# EAGLE design LDR (EAGLE 9.6.2)
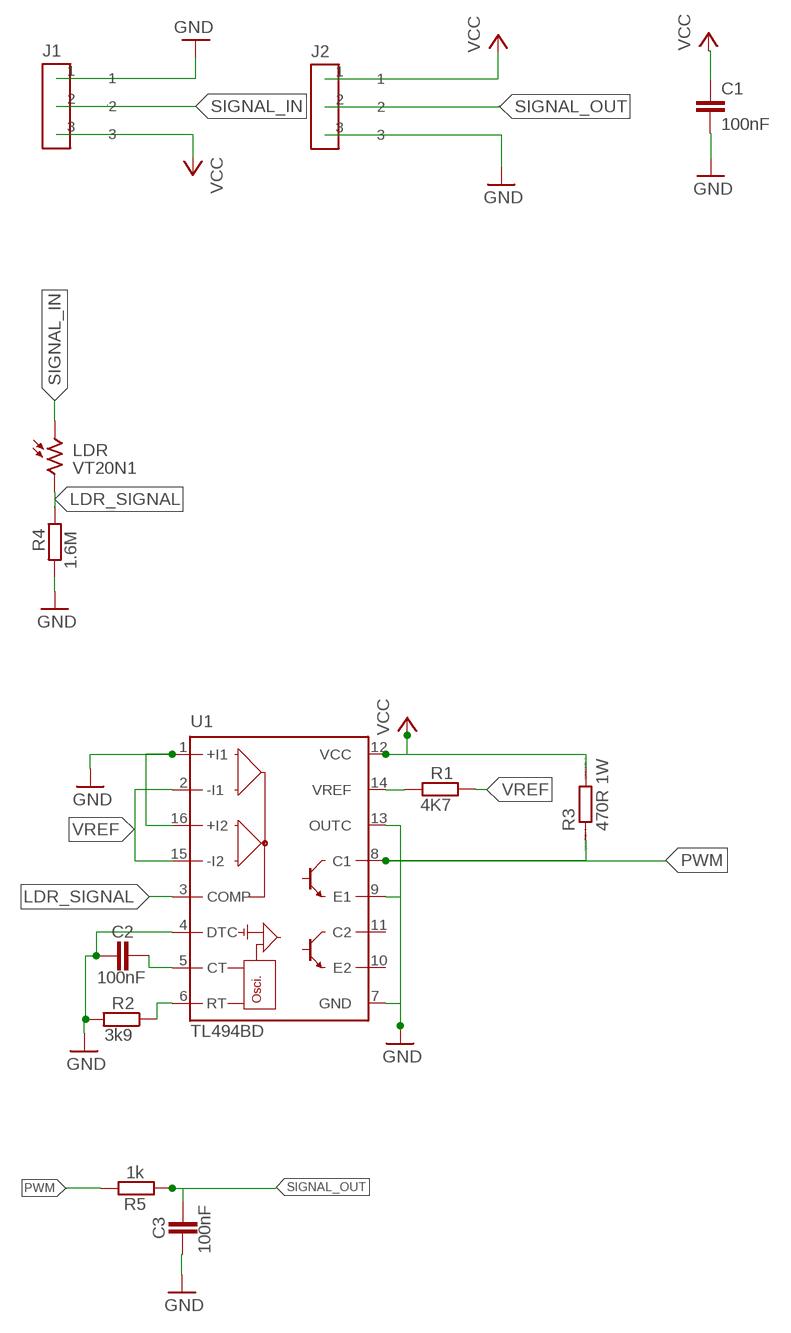
[diagram p0: schematic, sheet 1]

## Parts
C1  100nF  C-EUC0805  [C0805]
C2  100nF  C-EUC0805  [C0805]
C3  100nF  C-EUC0805  [C0805]
J1  CONECTOR_MACHO  [MALE]
J2  CONECTOR_FEMEA  [FEMALE]
LDR  VT20N1  [TO46-VT200]
R1  4K7  R-EU_R0805W  [R0805W]
R2  3k9  R-EU_R0805W  [R0805W]
R3  470R 1W  RR2512  [R2512]
R4  1.6M  R-EU_R0805W  [R0805W]
R5  1k  R-EU_R0805W  [R0805W]
U1  TL494BD  [SO16]

## Nets
GND: C1.2 C2.1 C3.1 J1.1 J2.3 R2.2 R4.2 U1.1(+I1) U1.4(DTC) U1.7(GND) U1.9(E1) U1.13(OUTC) U1.16(+I2)
LDR_SIGNAL: LDR.2 R4.1 U1.3(COMP)
N$2: C2.2 U1.5(CT)
N$3: R1.2 U1.14(VREF)
N$4: R2.1 U1.6(RT)
PWM: R3.1 R5.1 U1.8(C1)
SIGNAL_IN: J1.2 LDR.1
SIGNAL_OUT: C3.2 J2.2 R5.2
VCC: C1.1 J1.3 J2.1 R3.2 U1.12(VCC)
VREF: R1.1 U1.2(-I1) U1.15(-I2)
Unconnected: U1.10(E2) U1.11(C2)

## Library data of the parts
C1-C3 = rcl:C-EU: CAPACITOR, European symbol; SPICEPREFIX: C
J1 = Eletroblocks Lib:CONECTOR_MACHO
J2 = Eletroblocks Lib:CONECTOR_FEMEA
LDR = photo-elements:VT2*: Photoconductive Cell VT200 Series Source: http://optoelectronics.perkinelmer.com/content/Datasheets/DTS_vt200seriesdatasheet.pdf
R1 R2 R4 R5 = rcl:R-EU_: RESISTOR, European symbol; SPICEPREFIX: R
R3 = eagle-ltspice:R: RESISTOR, European symbol; SPICEMODEL: NONE; SPICEPREFIX: R
U1 = linear:TL494*: SWITCHMODE Pulse Width Modulation Control Circuit NCV494B http://onsemi.com tl494-d.pdf

## Board
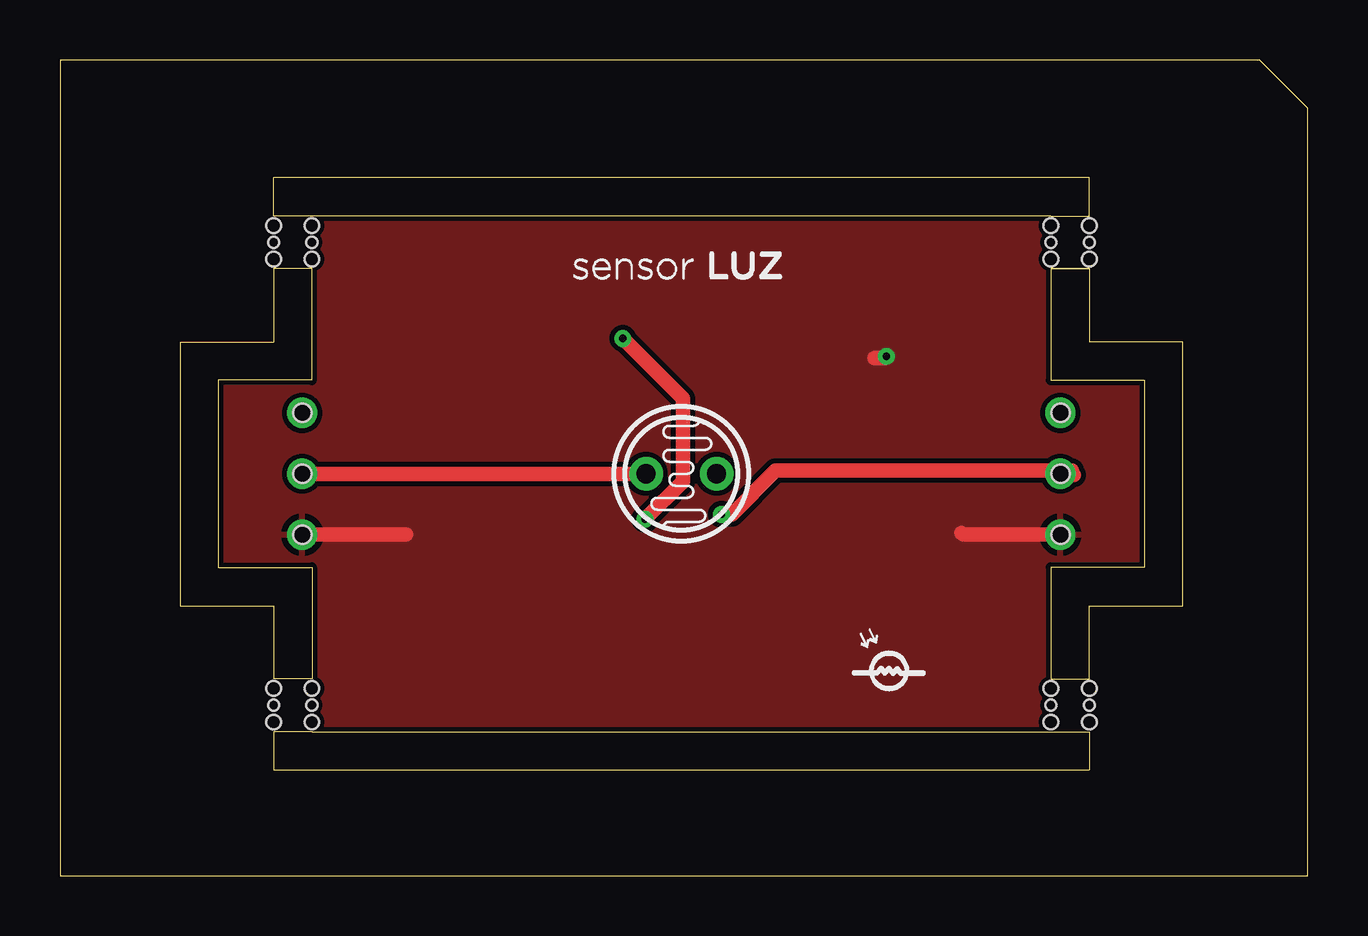
[diagram p1: board, top side]
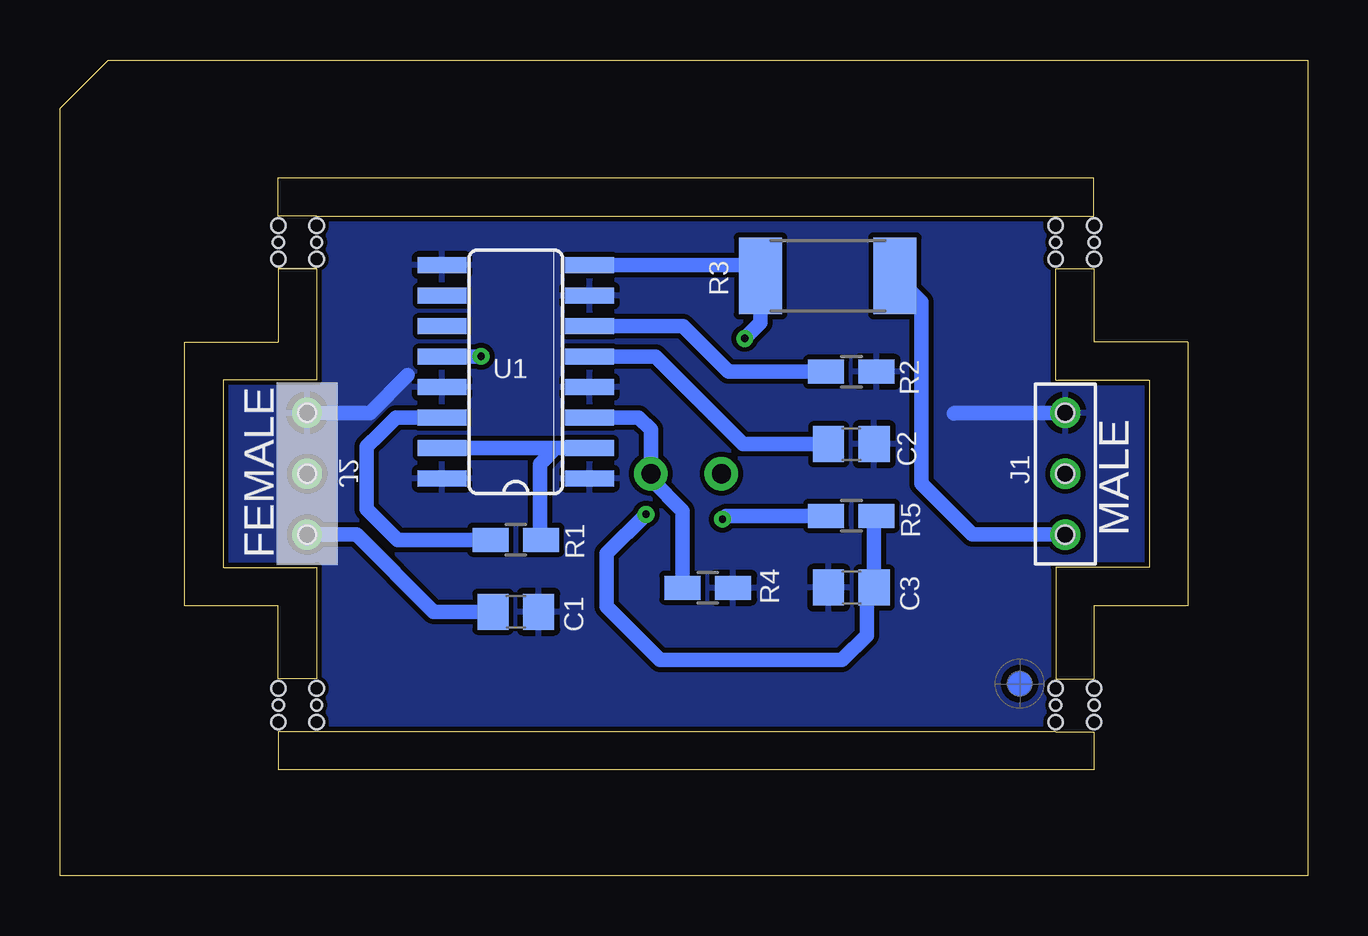
[diagram p2: board, bottom side, seen from below]

Size 52 x 34 mm. Coordinates in mm from the lower left corner, seen from the top.
Outline: 10.5,6 41.3,6
Outline: 41.3,27.5 10.5,27.5
Outline: 8.9,6 8.9,4.4 42.9,4.4 42.9,6
Outline: 42.9,27.5 42.9,29.1 8.9,29.1 8.9,27.5
Outline: 8.9,25.3 8.9,22.25 5,22.25 5,11.25 8.9,11.25 8.9,8.2
Outline: 10.5,8.2 10.5,12.85 6.6,12.85 6.6,20.65 10.5,20.65 10.5,25.3
Outline: 46.8,11.25 46.8,22.25 42.9,22.25 42.9,25.3 41.3,25.3 41.3,20.65 45.2,20.65 45.2,12.85 41.3,12.85 41.3,8.2 42.9,8.2 42.9,11.25 46.8,11.25
Outline: 0,34 0,0 52,0 52,32 50,34 0,34
Copper layers (1*16): Top 0.035mm / dielectric 1.5mm / Bottom 0.035mm
Design rules "default *": minimum track width 6mil, minimum drill 0.35mm, track to track 8mil, track to pad 8mil, pad to pad 8mil, via to via 8mil, smd to smd 8mil, copper to edge 8mil, drill to drill 8mil, minimum pad ring 10mil, minimum via ring 8mil, stop-mask expansion 4mil, vias tented up to drill 3mm, thermal gap 10mil

### Footprints (pad centres in the part's own frame; a part is rotated, then mirrored left to right if it is on the bottom)
C0805 = smd 1.3 x 1.5: 1 -0.95,0; 2 0.95,0
MALE = drill 0.75: 1 0,2.54; 2 0,0; 3 0,-2.54 | hole 0.75: 0,2.54; 0,0; 0,-2.54
FEMALE = drill 0.75: 1 0,2.54; 2 0,0; 3 0,-2.54 | hole 0.75: 0,2.54; 0,0; 0,-2.54
TO46-VT200 = drill 0.8 pad 1.4: 1 -1.47,0; 2 1.47,0
R0805W = smd 1.5 x 1: 1 -1.052,0; 2 1.052,0
R2512 = smd 1.8 x 3.2: 1 -2.8,0; 2 2.8,0
SO16 = smd 0.66 x 2.032: 1 -4.445,-3.073; 2 -3.175,-3.073; 3 -1.905,-3.073; 4 -0.635,-3.073; 5 0.635,-3.073; 6 1.905,-3.073; 7 3.175,-3.073; 8 4.445,-3.073; 9 4.445,3.073; 10 3.175,3.073; 11 1.905,3.073; 12 0.635,3.073; 13 -0.635,3.073; 14 -1.905,3.073; 15 -3.175,3.073; 16 -4.445,3.073
STAMP_DUPLO = hole 0.45: 0,0; 0,-1.6 | hole 0.6: 0.7,0; -0.7,0; 0.7,-1.6; -0.7,-1.6

### Placement (x,y rotation side)
C1  33,11 0 bottom
C2  19.01,17.98 180 bottom
C3  19.01,12.01 0 bottom
J1  10.1,16.75 0 top
J2  41.7,16.75 180 top
LDR  25.9,16.75 0 top
R1  33,14 180 bottom
R2  19.01,21.01 0 bottom
R3  20,25 0 bottom
R4  25,12 0 bottom
R5  19.01,15 0 bottom
U1  33,21 90 bottom
U$1  [FIDUCIAL_G10]  12,8 0 bottom
U$2  [STAMP_DUPLO]  10.5,7.1 270 top
U$3  [STAMP_DUPLO]  10.5,26.4 270 top
U$4  [STAMP_DUPLO]  41.3,26.4 90 top
U$5  [STAMP_DUPLO]  41.3,7.1 90 top

### Tracks (layer width: path | path; a pad name or v marks a point on that pad's centre or on a via)
GND
  Bottom 0.61: J1.1 14.72,19.29 14.75,19.26 | J2.3 39.08,19.29 37.5,20.86
  pour Bottom: 6.5,6 45.4,6 45.4,27.5 6.5,27.5
LDR_SIGNAL
  Bottom 0.61: 29.9,19.12 U1.3 27.88,19.09 27.37,18.59 LDR.2 27.37,16.52 26.05,15.21 R4.1
N$2
  Bottom 0.61: U1.5 27.18,21.63 23.53,17.98 C2.2
N$3
  Bottom 0.61: R1.2 37.93,14 39.21,15.28 39.21,17.88 38.68,18.41 37.99,19.09 U1.14
N$4
  Bottom 0.61: R2.1 24.13,21.01 26.03,22.91 U1.6
PWM  (via drill 0.3)
  Top 0.61: v23.46,22.39 25.96,19.89 25.96,16.43 v24.38,14.85
  Bottom 0.61: U1.8 23.24,25.45 R3.1 22.8,23.05 v23.46,22.39 | v24.38,14.85 24.24,15 R5.1
SIGNAL_IN
  Top 0.61: J1.2 LDR.1
SIGNAL_OUT  (via drill 0.3)
  Top 0.61: 42.25,16.7 J2.2 42.17,16.88 29.83,16.88 28.01,15.06 v27.58,15.06
  Bottom 0.61: R5.2 18.06,14.89 C3.2 18.37,11.7 18.37,10.02 19.41,8.99 26.98,8.99 29.22,11.23 29.22,13.42 v27.58,15.06
VCC  (via drill 0.3)
  Top 0.61: J1.3 14.42,14.21 14.43,14.21 | v34.45,21.65 34.38,21.57 33.95,21.57 | J2.1 37.65,14.21 37.58,14.29
  Bottom 0.61: J2.1 39.63,14.21 36.42,11 C1.1 | R3.2 16.1,23.9 16.1,16.35 13.96,14.21 J1.3 | U1.12 34.46,21.63 v34.45,21.65
  pour Top: 6.4,6 45.49,6 45.49,27.48 6.4,27.48
VREF
  Bottom 0.61: U1.15 U1.2 31.33,17.82 31.99,17.17 31.99,14.05 R1.1

### Text on the board
tStop: V1.1.1
bStop: V1.1.1